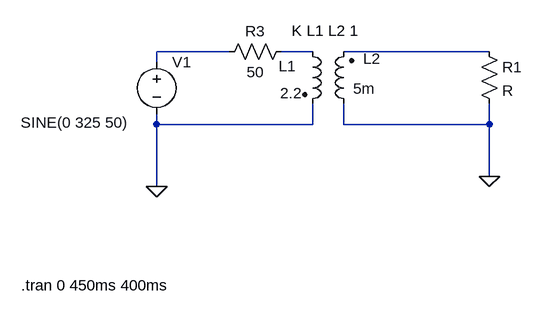
[diagram p0: schematic power_supply.asc]
power_supply.asc, the LTspice schematic file:
Version 4
SHEET 1 1496 680
WIRE -224 144 -336 144
WIRE -96 144 -144 144
WIRE 176 144 -48 144
WIRE -336 160 -336 144
WIRE -336 256 -336 240
WIRE -96 256 -96 224
WIRE -96 256 -336 256
WIRE -48 256 -48 224
WIRE 176 256 176 224
WIRE 176 256 -48 256
WIRE 176 336 176 256
WIRE -336 352 -336 256
FLAG -336 352 0
FLAG 176 336 0
SYMBOL voltage -336 144 R0
WINDOW 3 -209 109 Left 2
WINDOW 123 0 0 Left 0
WINDOW 39 0 0 Left 0
SYMATTR Value SINE(0 325 50)
SYMATTR InstName V1
SYMBOL res -128 128 R90
WINDOW 0 0 56 VBottom 2
WINDOW 3 32 56 VTop 2
SYMATTR InstName R3
SYMATTR Value 50
SYMBOL ind2 -112 128 R0
WINDOW 0 -36 38 Left 2
WINDOW 3 -34 80 Left 2
SYMATTR InstName L1
SYMATTR Value 2.2
SYMATTR Type ind
SYMBOL ind2 -32 240 R180
WINDOW 0 -41 85 Left 2
WINDOW 3 -32 39 Left 2
SYMATTR InstName L2
SYMATTR Value 5m
SYMATTR Type ind
SYMBOL res 160 128 R0
SYMATTR InstName R1
TEXT -544 504 Left 2 !.tran 0 450ms 400ms
TEXT -128 112 Left 2 !K L1 L2 1

The netlist it stands for:
* power_supply.asc
V1 N001 0 SINE(0 325 50)
R3 N002 N001 50
L1 N002 0 2.2
L2 0 N003 5m
R1 N003 0 R
.tran 0 450ms 400ms
K L1 L2 1
.backanno
.end